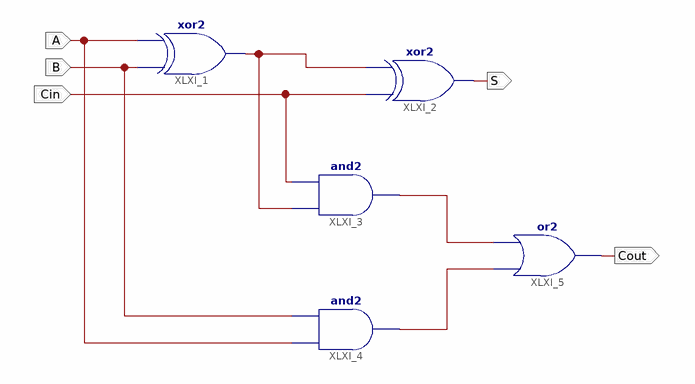
[diagram p0: schematic sheet 1]
// Xilinx ISE schematic FullAdder.sch (spartan6) as structural Verilog: 5 symbols, 5 ports
module FullAdder (
  input  A,
  input  B,
  input  Cin,
  output S,
  output Cout
);

  wire XLXN_8, XLXN_9, XLXN_10;

  xor XLXI_1 (XLXN_8, B, A);
  xor XLXI_2 (S, Cin, XLXN_8);
  and XLXI_3 (XLXN_9, XLXN_8, Cin);
  and XLXI_4 (XLXN_10, A, B);
  or XLXI_5 (Cout, XLXN_10, XLXN_9);
endmodule
